# EAGLE design RFM95 LoRa Shield v0.2 (EAGLE 9.2.0)
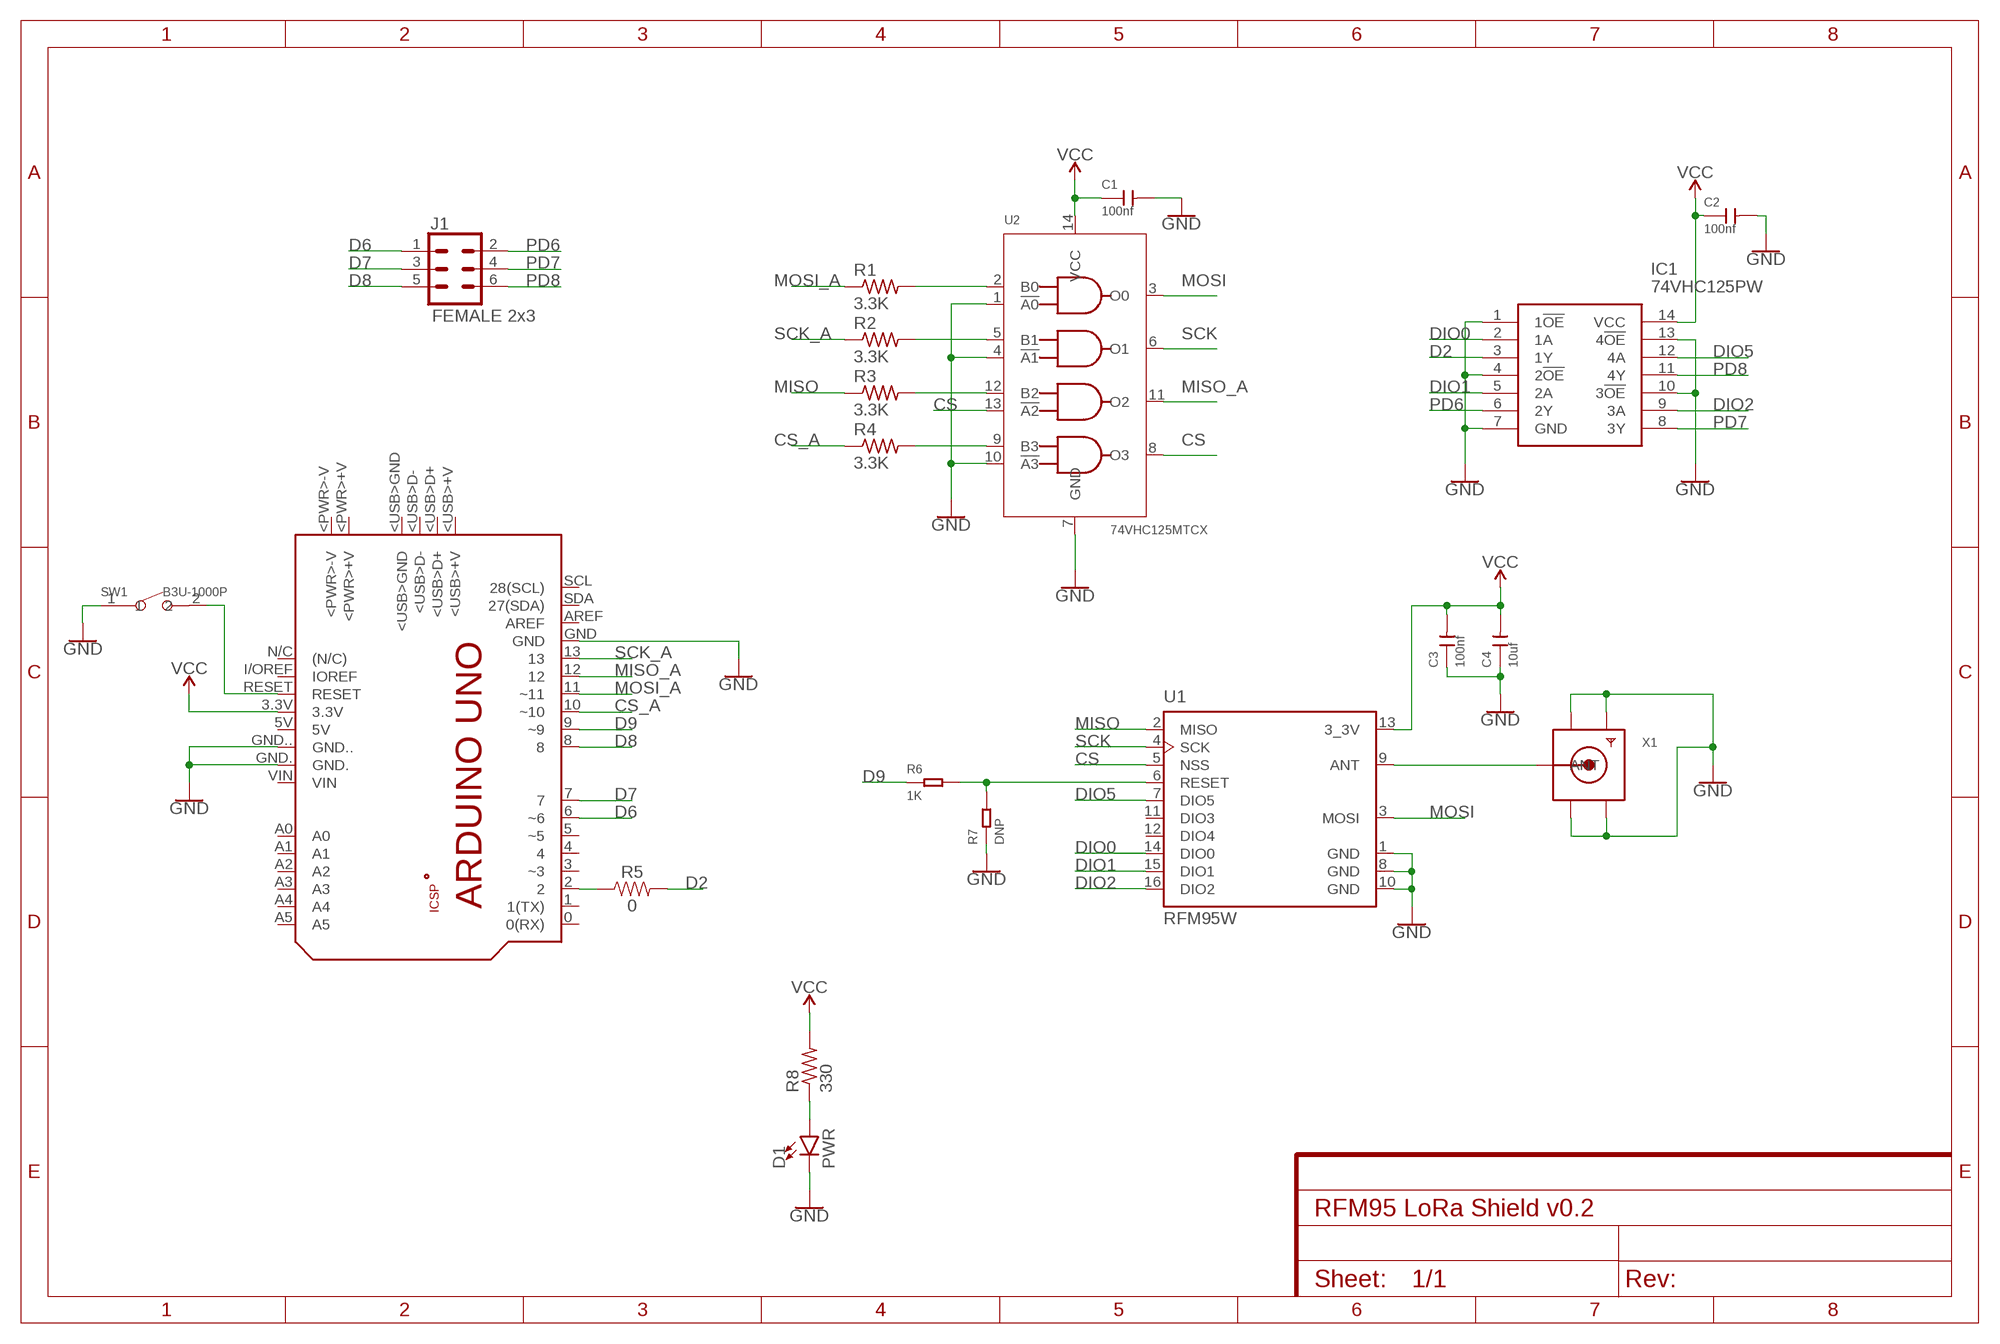
[diagram p0: schematic, sheet 1]

## Parts
C1  100nf  CERAMIC-100NF-50V-10%-X7R(0805)  [C0805]
C2  100nf  CERAMIC-100NF-50V-10%-X7R(0805)  [C0805]
C3  100nf  CERAMIC-100NF-50V-10%-X7R(0805)  [C0805]
C4  10uf  CERAMIC-10UF-25V-10%-X5R(0805)  [C0805]
D1  PWR  LED-GREEN1206  [LED-1206]
IC1  74VHC125PW  74VHC125PW,118  [SOP65P640X110-14N]
J1  FEMALE 2x3  CONN_03X2FEMALE  [2X3]
PCB1  Arduino Uno  ARDUINO_UNO  [ARDUINO_UNO]
R1  3.3K  R-US_M0805  [M0805]
R2  3.3K  R-US_M0805  [M0805]
R3  3.3K  R-US_M0805  [M0805]
R4  3.3K  R-US_M0805  [M0805]
R5  0  0OHM-0603-1/10W-5%  [0603]
R6  1K  SMD-RES-1K-5%-1/8W(0805)  [R0805]
R7  DNP  SMD-RES-1K-5%-1/8W(0805)  [R0805]
R8  330  R-US_M0805  [M0805]
SW1  B3U-1000P  SMD-BUTTON(2P-3.0X2.5X1.2+0.4MM)-B3U-1000P-2P-SMD  [SW2-2.6-3.0X2.5X1.2+0.4MM]
U1  RFM95W  RFM95W-868S2  [XCVR_RFM95W-868S2]
U2  74VHC125MTCX  LOGIC-74VHC125MTCX(TSSOP14)  [TSSOP14-0.65-5X4.4MM]
X1  SMACONNECTOR  [SMA90_DIP]

## Nets
CS: U1.5(NSS) U2.8(O3) U2.13(!A2)
CS_A: PCB1.10(~10) R4.1
D2: IC1.3(1Y) R5.2
D6: J1.1 PCB1.6(~6)
D7: J1.3 PCB1.7
D8: J1.5 PCB1.8
D9: PCB1.9(~9) R6.1
DIO0: IC1.2(1A) U1.14(DIO0)
DIO1: IC1.5(2A) U1.15(DIO1)
DIO2: IC1.9(3A) U1.16(DIO2)
DIO5: IC1.12(4A) U1.7(DIO5)
GND: C1.2 C2.2 C3.1 C4.1 D1.C IC1.1(1!OE) IC1.4(2!OE) IC1.7(GND) IC1.10(3!OE) IC1.13(4!OE) PCB1.GND PCB1.GND. PCB1.GND.. R7.1 SW1.1 U1.1(GND) U1.8(GND) U1.10(GND) U2.1(!A0) U2.4(!A1) U2.7(GND) U2.10(!A3) X1.GND1 X1.GND2 X1.GND3 X1.GND4
MISO: R3.1 U1.2(MISO)
MISO_A: PCB1.12 U2.11(O2)
MOSI: U1.3(MOSI) U2.3(O0)
MOSI_A: PCB1.11(~11) R1.1
N$1: R1.2 U2.2(B0)
N$2: R2.2 U2.5(B1)
N$3: R3.2 U2.12(B2)
N$4: R4.2 U2.9(B3)
N$5: PCB1.2 R5.1
N$6: R6.2 R7.2 U1.6(RESET)
N$7: U1.9(ANT) X1.ANTENNA(ANT)
N$8: PCB1.RESET SW1.2
N$9: D1.A R8.1
PD6: IC1.6(2Y) J1.2
PD7: IC1.8(3Y) J1.4
PD8: IC1.11(4Y) J1.6
SCK: U1.4(SCK) U2.6(O1)
SCK_A: PCB1.13 R2.1
VCC: C1.1 C2.1 C3.2 C4.2 IC1.14(VCC) PCB1.3.3V R8.2 U1.13(3_3V) U2.14(VCC)
Unconnected: PCB1.0(0(RX)) PCB1.1(1(TX)) PCB1.3(~3) PCB1.4 PCB1.5(~5) PCB1.5V PCB1.+5V PCB1.<PWR>+V PCB1.<PWR>-V PCB1.<USB>+V PCB1.<USB>D+ PCB1.<USB>D- PCB1.<USB>GND PCB1.A0 PCB1.A1 PCB1.A2 PCB1.A3 PCB1.A4 PCB1.A5 PCB1.AREF PCB1.GND_ PCB1.I/OREF(IOREF) PCB1.MISO PCB1.MOSI PCB1.N/C((N/C)) PCB1.RESET. PCB1.SCK PCB1.SCL(28(SCL)) PCB1.SDA(27(SDA)) PCB1.VIN U1.11(DIO3) U1.12(DIO4)

## Library data of the parts
C1-C3 = Seeed-Capacitor:CERAMIC-100NF-50V-10%-X7R(0805): 302010165; MPN: CC0805KRX7R9BB104
C4 = Seeed-Capacitor:CERAMIC-10UF-25V-10%-X5R(0805): 302010178; MPN: CC0805KKX5R8BB106
D1 = SparkFun-LED:LED-GREEN: Green SMD LED Used in manufacturing of various products at SparkFun Packages: 0603 - SMD 0603 package [Product Link] <http://www.futureelectronics.com/en/technologies/semiconductors/optoelectronics/leds/Pages/9894312-LTST-C190GKT.aspx?CrossPart=HSMG-C190&IM=0> LilyPad 1206 - SMD1206 LilyPad package [Product Link] <http://www.futureelectronics.com/en/Technologies/Product.aspx?ProductID=IN150NGHARVATEKCORPORATION2049943&IM=0> 1206 - SMD1206 package [Product Link] <http://www.futureelectronics.com/en/technologies/semiconductors/optoelectronics/leds/Pages/8315665-LTST-C150KGKT.aspx?IM=0> 1206 Bottom Mount -SMD 1206 Bottom Mount [Product Link] <http://www.digikey.com/product-detail/en/lite-on-inc/LTST-C230KGKT/160-1456-1-ND/386854> SparkFun Products: Pro Mini 328 -5V <https://www.sparkfun.com/products/821> RedBoard <https://www.sparkfun.com/products/12757> MP3 Trigger <https://www.sparkfun.com/products/13720> Makey Makey <https://www.sparkfun.com/products/11076>; PROD_ID: DIO-00862; VALUE: GREEN
IC1 = 74VHC125PW_118:74VHC125PW,118: Buffers & Line Drivers CMOS 4CH NON-INVERT Source: Datasheet <https://assets.nexperia.com/documents/data-sheet/74VHC_VHCT125.pdf>; DESCRIPTION: Buffers & Line Drivers CMOS 4CH NON-INVERT; HEIGHT: 1.1mm; MANUFACTURER_NAME: Nexperia; MANUFACTURER_PART_NUMBER: 74VHC125PW,118
J1 = SparkFun-Connectors:CONN_03X2: Multi connection point. Often used as Generic Header-pin footprint for 0.1 inch spaced/style header connections You can populate with any combo of single row headers, but if you'd like an exact match, check these: Header - 2x3 (Male, 0.1") <https://www.sparkfun.com/products/12807> (PRT-12807) Header - 2x3 (Female, 0.1") <https://www.sparkfun.com/products/13010> (PRT-13010) 2x3 Pin Shrouded Header <https://www.sparkfun.com/products/10877> (PRT-10877) On any of the 0.1 inch spaced packages, you can populate with these: Break Away Headers - Straight <https://www.sparkfun.com/products/116> (PRT-00116) Break Away Male Headers - Right Angle <https://www.sparkfun.com/products/553> (PRT-00553) Female Headers <https://www.sparkfun.com/products/115> (PRT-00115) Break Away Headers - Machine Pin <https://www.sparkfun.com/products/117> (PRT-00117) Break Away Female Headers - Swiss Machine Pin <https://www.sparkfun.com/products/743> (PRT-00743) Special note: the shrouded connector mates well with our 3x2 ribbon cables: Ribbon Crimp Connector - 6-pin (2x3, Female) <https://www.sparkfun.com/products/10651> (PRT-10651) Ribbon Cable - 6 wire (15ft) <https://www.sparkfun.com/products/10646> (PRT-10646); PROD_ID: CONN-11566
PCB1 = E14_Arduino_revC:ARDUINO_UNO: Device for representing an Arduino Uno board with a footprint in an EAGLE design. Created by Dave Young for Element14. More EAGLE documentation at: http://www.element14.com/community/community/knode/cadsoft_eagle
R1-R4 R8 = resistor:R-US_: RESISTOR, American symbol
R5 = SparkFun-Resistors:0OHM: 0Ω resistor A resistor is a passive two-terminal electrical component that implements electrical resistance as a circuit element. Resistors act to reduce current flow, and, at the same time, act to lower voltage levels within circuits. - Wikipedia; PROD_ID: RES-08609
R6 = Seeed-Resistor:SMD-RES-1K-5%-1/8W(0805): 301010311; MPN: RC0805JR-071KL
R7 = Seeed-Resistor:SMD-RES-1K-5%-1/8W(0805): 301010311; MPN: RC0805JR-071KL; VALUE: 1K
SW1 = Seeed-Switch:SMD-BUTTON(2P-3.0X2.5X1.2+0.4MM): 311020047; MPN: B3U-1000P-2P-SMD; VALUE: B3U-1000P-2P-SMD
U1 = RFM95W-868S2:RFM95W-868S2: Mod Txrx Lora +20dbm 868mhz Smd; MF: RF; MP: RFM95W-868S2; PACKAGE: SMD-16 Hope Microelectronics
U2 = Seeed-IC:LOGIC-74VHC125MTCX(TSSOP14): 310050042; MPN: 74VHC125MTCX; VALUE: 74VHC125MTCX-TSSOP14
X1 = adafruit:SMACONNECTOR: SMA Connector 90° DIP SMA Connector, 50 Ohm (4UConnector: 07259)

## Board
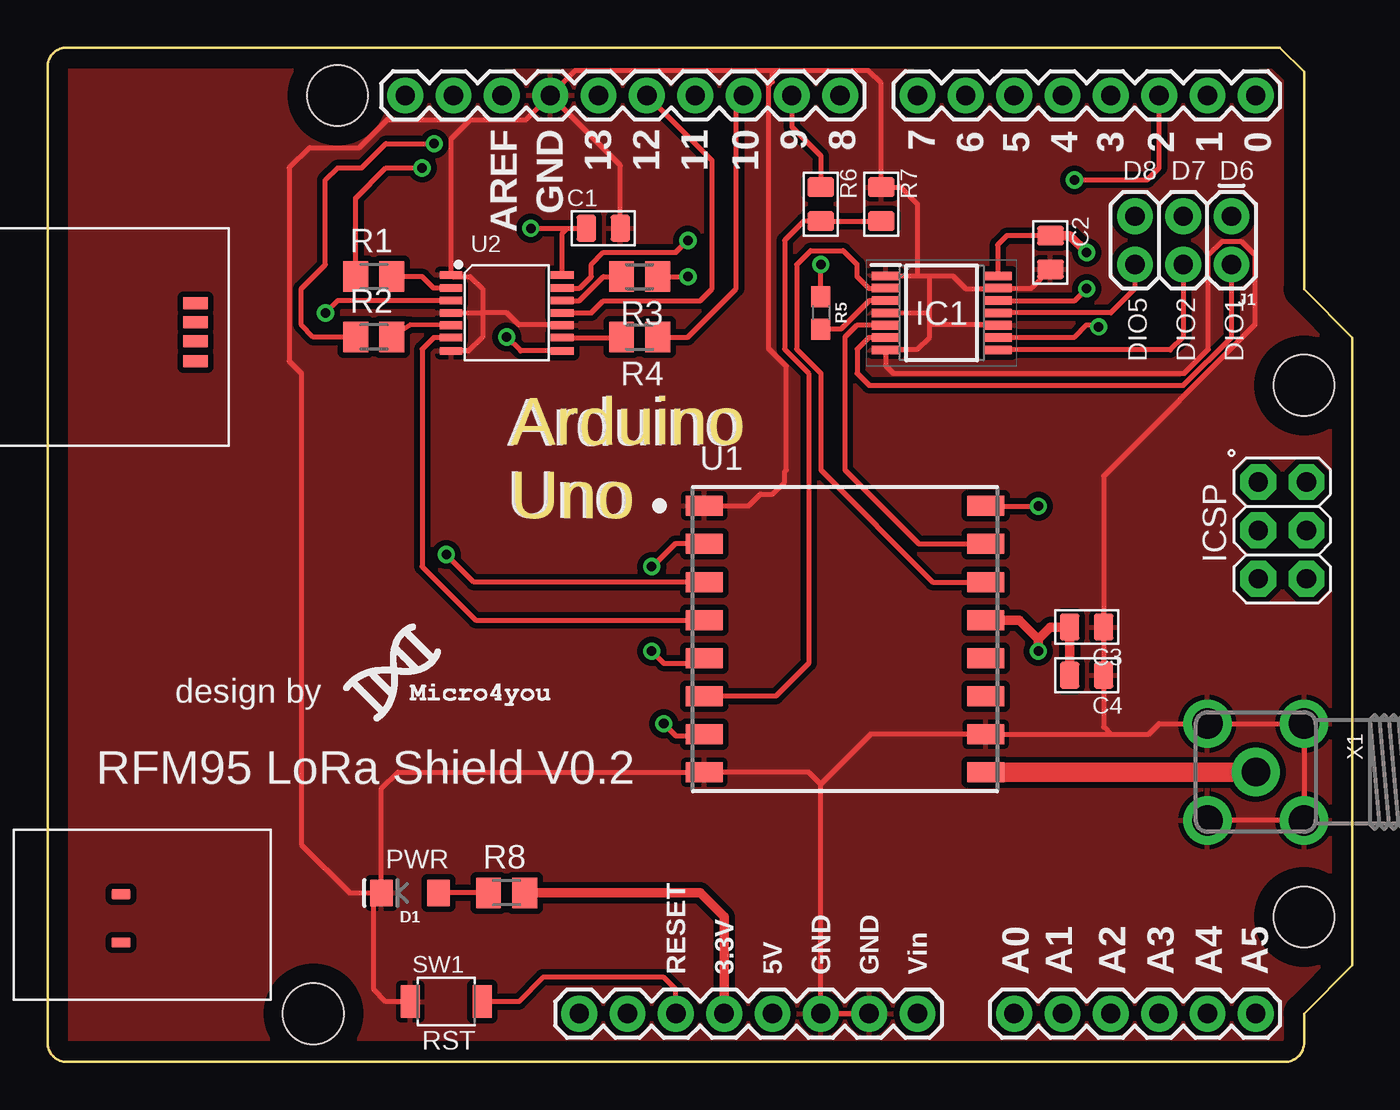
[diagram p1: board, top side]
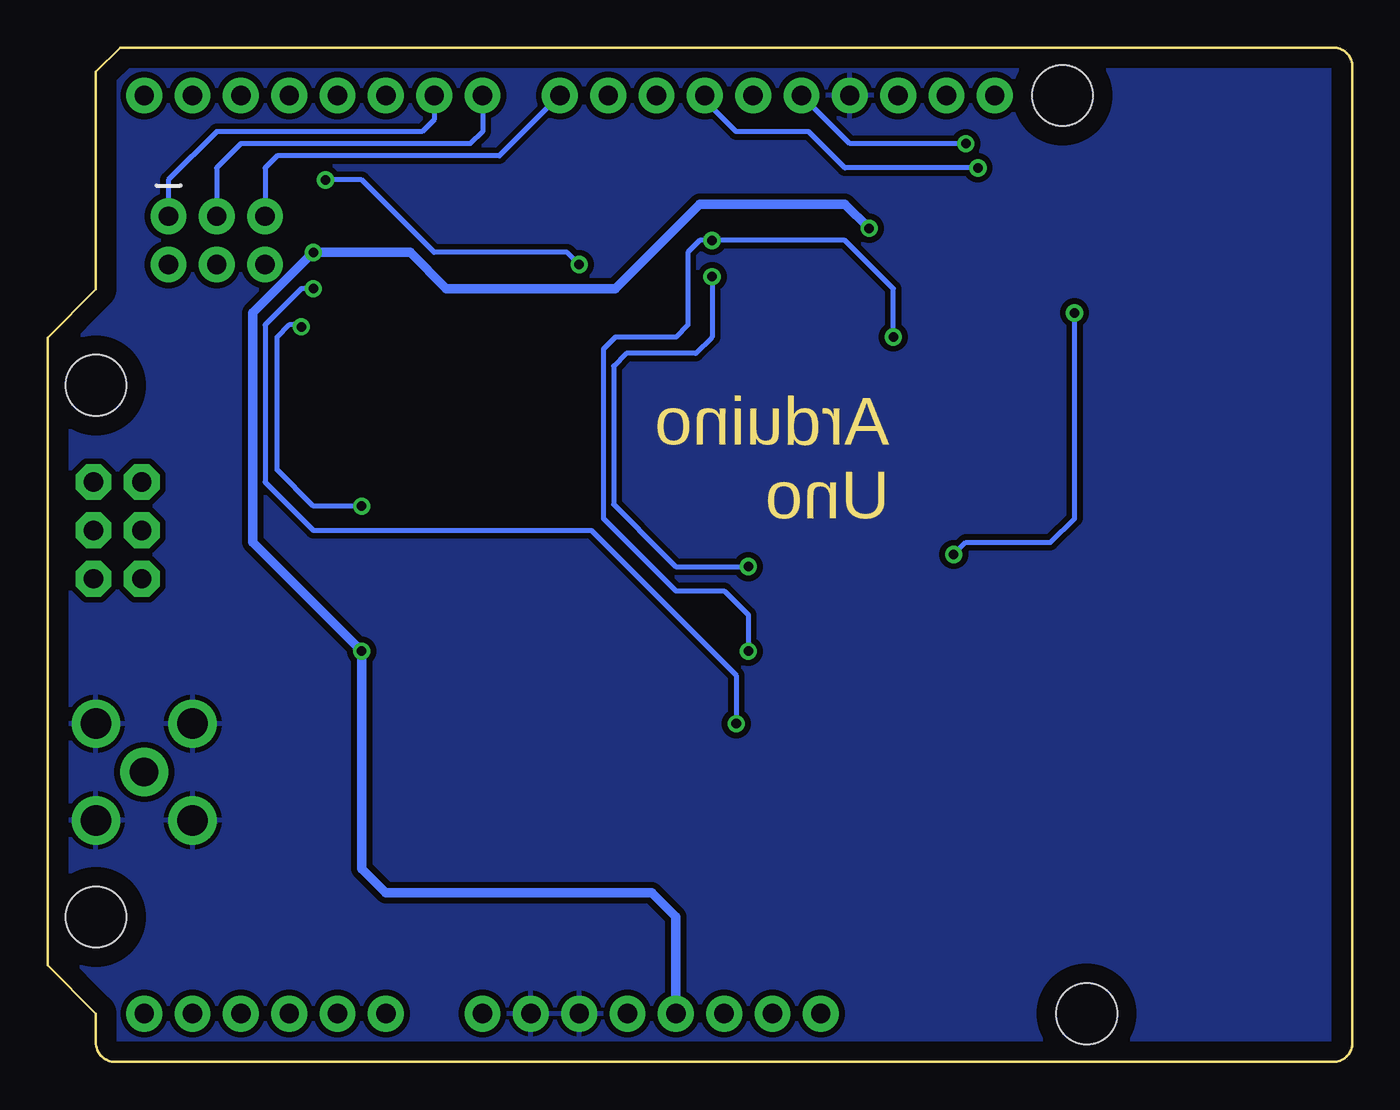
[diagram p2: board, bottom side, seen from below]

Size 68.58 x 53.31 mm. Coordinates in mm from the lower left corner, seen from the top.
Copper layers (1*16): Top 0.035mm / dielectric 1.5mm / Bottom 0.035mm
Design rules "default": minimum track width 6mil, minimum drill 0.35mm, track to track 6mil, track to pad 6mil, pad to pad 6mil, via to via 6mil, smd to smd 6mil, copper to edge 40mil, drill to drill 6mil, minimum pad ring 10mil, minimum via ring 8mil, stop-mask expansion 4mil, vias tented up to drill 0mil, thermal gap 10mil

### Footprints (pad centres in the part's own frame; a part is rotated, then mirrored left to right if it is on the bottom)
C0805 = smd 1.397 x 1.016: 1 0,0.889; 2 0,-0.889
LED-1206 = smd 1.2 x 1.4: A -1.5,0; C 1.5,0
SOP65P640X110-14N = smd 1.475 x 0.45: 1 -2.938,1.95; 2 -2.938,1.3; 3 -2.938,0.65; 4 -2.938,0; 5 -2.938,-0.65; 6 -2.938,-1.3; 7 -2.938,-1.95; 8 2.938,-1.95; 9 2.938,-1.3; 10 2.938,-0.65; 11 2.938,0; 12 2.938,0.65; 13 2.938,1.3; 14 2.938,1.95
2X3 = drill 1.016 pad 1.88: 1 0,0; 2 0,2.54; 3 2.54,0; 4 2.54,2.54; 5 5.08,0; 6 5.08,2.54
ARDUINO_UNO = drill 1.016 pad 1.88: 0 63.5,50.8; 1 60.96,50.8; 2 58.42,50.8; 3 55.88,50.8; 3.3V 35.56,2.54; 4 53.34,50.8; 5 50.8,50.8; 5V 38.1,2.54; 6 48.26,50.8; 7 45.72,50.8; 8 41.656,50.8; 9 39.116,50.8; 10 36.576,50.8; 11 34.036,50.8; 12 31.496,50.8; 13 28.956,50.8; A0 50.8,2.54; A1 53.34,2.54; A2 55.88,2.54; A3 58.42,2.54; A4 60.96,2.54; A5 63.5,2.54; AREF 23.876,50.8; GND 26.416,50.8; GND. 43.18,2.54; GND.. 40.64,2.54; I/OREF 30.48,2.54; N/C 27.94,2.54; RESET 33.02,2.54; SCL 18.796,50.8; SDA 21.336,50.8; VIN 45.72,2.54 | drill 1.016 pad 1.88 octagon: +5V 66.167,30.48; GND_ 66.167,25.4; MISO 63.627,30.48; MOSI 66.167,27.94; RESET. 63.627,25.4; SCK 63.627,27.94 | smd 1.016 x 0.508: <PWR>+V 3.861,8.814; <PWR>-V 3.861,6.274 | smd 1.27 x 0.635: <USB>+V 7.772,39.878; <USB>D+ 7.772,38.887; <USB>D- 7.772,37.871; <USB>GND 7.772,36.83 | hole 3.2: 66.04,7.62; 66.04,35.56; 15.24,50.8; 13.97,2.54
M0805 = smd 1.3 x 1.6: 1 -0.95,0; 2 0.95,0
0603 = smd 1.1 x 1: 1 -0.85,0; 2 0.85,0
R0805 = smd 1.397 x 1.016: 1 0,0.889; 2 0,-0.889
SW2-2.6-3.0X2.5X1.2+0.4MM = smd 1 x 1.7: 1 -1.9,0; 2 1.9,0
XCVR_RFM95W-868S2 = smd 1.95 x 1.05: 1 -7.4,7; 2 -7.4,5; 3 -7.4,3; 4 -7.4,1; 5 -7.4,-1; 6 -7.4,-3; 7 -7.4,-5; 8 -7.4,-7; 9 7.4,-7; 10 7.4,-5; 11 7.4,-3; 12 7.4,-1; 13 7.4,1; 14 7.4,3; 15 7.4,5; 16 7.4,7
TSSOP14-0.65-5X4.4MM = smd 0.4 x 1.2: 1 -2,-2.925; 2 -1.3,-2.925; 3 -0.65,-2.925; 4 0,-2.925; 5 0.65,-2.925; 6 1.3,-2.925; 7 2,-2.925; 8 2,2.925; 9 1.3,2.925; 10 0.65,2.925; 11 0,2.925; 12 -0.65,2.925; 13 -1.3,2.925; 14 -2,2.925
SMA90_DIP = drill 1.5 pad 2.54: ANTENNA 0,0 | drill 1.6 pad 2.54: GND1 -2.54,2.54; GND2 2.54,2.54; GND3 -2.54,-2.54; GND4 2.54,-2.54

### Placement (x,y rotation side)
C1  29.21,43.81 90 top
C2  52.71,42.55 0 top
C3  54.61,22.86 270 top
C4  54.61,20.32 270 top
D1  19.05,8.89 180 top
IC1  46.99,39.37 0 top
J1  62.23,44.45 180 top
PCB1  0,0 0 top
R1  17.14,41.27 0 top
R2  17.14,38.1 0 top
R3  31.12,41.27 180 top
R4  31.12,38.1 180 top
R5  40.64,39.37 270 top
R6  40.64,45.08 0 top
R7  43.82,45.08 0 top
R8  24.13,8.89 0 top
SW1  20.95,3.17 0 top
U1  41.91,22.22 0 top
U2  24.13,39.37 270 top
X1  63.5,15.24 270 top

### Tracks (layer width: path | path; a pad name or v marks a point on that pad's centre or on a via)
CS  (via drill 0.5)
  Top 0.254: U2.13 27.97,40.67 28.57,41.27 28.57,41.91 29.21,42.55 33.02,42.55 v33.66,43.18 | v31.75,21.59 32.38,20.96 34.24,20.96 U1.5 | U2.8 24.86,37.37 v24.13,38.1
  Bottom 0.254: v31.75,21.59 31.75,23.5 33.02,24.76 35.56,24.76 39.37,28.57 39.37,37.47 38.73,38.1 35.56,38.1 34.93,38.73 34.93,42.55 34.29,43.18 v33.66,43.18 26.67,43.18 24.13,40.64 v24.13,38.1
CS_A
  Top 0.254: R4.1 33.66,38.1 36.2,40.64 36.2,50.42 PCB1.10
D2
  Top 0.254: IC1.3 43.2,40.02 41.7,38.52 R5.2
D6
  Bottom 0.254: PCB1.6 48.26,49.53 48.9,48.89 59.69,48.89 62.23,46.36 J1.1
D7
  Bottom 0.254: PCB1.7 45.72,48.89 46.35,48.26 58.42,48.26 59.69,46.99 J1.3
D8
  Bottom 0.254: PCB1.8 44.83,47.62 56.51,47.62 57.15,46.99 J1.5
D9
  Top 0.254: PCB1.9 39.12,49.15 40.64,47.62 R6.1
DIO0
  Top 0.254: IC1.2 44.02,40.64 43.18,40.64 42.54,41.27 42.54,41.91 41.81,42.64 40.1,42.64 39.37,41.91 39.37,37.47 40.64,36.19 40.64,31.11 46.53,25.22 U1.14
DIO1
  Top 0.254: IC1.5 42.53,38.72 41.91,38.1 41.91,31.11 45.8,27.22 U1.15
DIO2  (via drill 0.5)
  Top 0.254: IC1.9 49.96,38.1 53.98,38.1 54.61,38.73 55.15,38.73 v55.24,38.64 | U1.16 49.32,29.21 v52.07,29.21
  Bottom 0.254: v55.24,38.64 55.34,38.73 55.88,38.73 56.51,38.1 56.51,31.11 54.61,29.21 v52.07,29.21
DIO5  (via drill 0.5)
  Top 0.254: IC1.12 53.99,40.02 v54.61,40.64 | v32.38,17.78 33.02,17.14 34.43,17.14 U1.7
  Bottom 0.254: v54.61,40.64 55.24,40.64 57.15,38.73 57.15,30.48 54.61,27.94 40.01,27.94 32.38,20.32 v32.38,17.78
GND
  Top 0.254: SW1.1 17.78,3.17 17.14,3.81 17.14,8.48 D1.C | PCB1.GND. PCB1.GND.. 40.64,14.6 | 40.64,14.6 40.01,15.24 39.99,15.22 34.93,15.22 U1.8 18.43,15.22 18.41,15.24 17.55,14.38 D1.C | 40.64,14.6 43.26,17.22 U1.10 55.88,17.22 | 55.88,17.22 57.87,17.22 58.42,17.78 X1.GND3 X1.GND1 X1.GND2 X1.GND4 | 55.88,17.22 55.5,17.61 C4.1 C3.1 55.5,30.79 63.45,38.74 63.45,42.41 62.73,43.13 61.73,43.13 61.01,42.41 61.01,37.46 59.75,36.19 44.45,36.19 44.05,36.59 IC1.7 44.1,37.47 45.72,37.47 46.35,38.1 46.35,38.73 | 22.86,39.37 22.86,40.64 22.23,41.27 21.3,41.27 U2.1 21.2,48.51 22.23,49.53 | 22.86,39.37 22.86,38.1 22.13,37.37 U2.7 | U2.4 22.86,39.37 | U2.10 27.04,38.73 24.77,38.73 24.13,39.37 22.86,39.37 | D1.C 15.88,8.89 13.34,11.43 13.34,36.19 12.7,36.83 12.7,46.99 13.77,48.06 16.38,48.06 17.85,49.53 22.23,49.53 | PCB1.GND 25.15,49.53 22.23,49.53 | C1.2 30.1,47.12 PCB1.GND | U1.1 36.85,29.22 37.46,29.84 38.1,29.84 38.73,30.48 38.73,31.02 38.83,31.12 38.83,36.57 37.9,37.5 37.9,51.3 38.1,51.51 38.1,52.11 | C2.2 51.72,40.67 IC1.13 49.9,40.64 48.26,40.64 47.58,41.32 46.35,41.32 | IC1.1 45.72,41.32 | 45.72,41.32 46.35,41.32 | 45.72,41.32 45.72,45.08 44.83,45.97 R7.1 43.82,51.43 43.14,52.11 38.1,52.11 | PCB1.GND 27.72,52.11 38.1,52.11 | 46.35,38.73 46.35,39.37 | 46.35,39.37 46.35,41.32 | IC1.4 46.35,39.37 | IC1.10 49.91,38.73 46.35,38.73
  pour Top (isolate 0.305): 0,53.34 69.22,53.34 69.22,1.27 67.94,0 0,0
  pour Bottom (isolate 0.305): 0,53.34 69.85,53.34 69.85,0.63 69.22,0 0,0
MISO  (via drill 0.5)
  Top 0.254: R3.1 v33.66,41.27 | U1.2 32.98,27.22 31.79,26.04 v31.75,26.04
  Bottom 0.254: v33.66,41.27 33.66,38.1 34.52,37.24 38.16,37.24 38.83,36.57 38.83,29.3 36.2,26.67 36.09,26.56 35.56,26.04 v31.75,26.04
MISO_A
  Top 0.254: U2.11 28.57,39.37 29.21,40 34.29,40 34.93,40.64 34.93,47.37 PCB1.12
MOSI  (via drill 0.5)
  Top 0.254: 21.19,40 U2.3 15.26,40.02 v14.6,39.37 | U1.3 22.4,25.22 v20.95,26.67
  Bottom 0.254: v20.95,26.67 20.32,27.3 15.88,27.3 14.6,28.57 v14.6,39.37
MOSI_A  (via drill 0.5)
  Top 0.254: R1.1 16.2,45.41 17.78,46.99 v19.69,46.99
  Bottom 0.254: v19.69,46.99 26.67,46.99 28.57,48.89 32.38,48.89 34.04,50.55 PCB1.11
N$1
  Top 0.254: 21.17,40.64 arc90 U2.2 20.29,40.67 19.69,41.27 R1.2
N$2
  Top 0.254: U2.5 19.05,38.73 R2.2
N$3
  Top 0.254: U2.12 27.95,40.02 29.21,41.27 R3.2
N$4
  Top 0.254: 27.09,38.1 U2.9 30.13,38.07 R4.2
N$5  (via drill 0.5)
  Top 0.254: R5.1 v40.64,41.91 | v53.98,46.36 57.79,46.36 58.42,46.99 PCB1.2
  Bottom 0.254: v40.64,41.91 41.27,42.55 48.26,42.55 52.07,46.36 v53.98,46.36
N$6
  Top 0.254: R7.2 R6.2 39.75,44.2 38.73,43.18 38.73,37.47 40.01,36.19 40.01,20.96 38.27,19.22 U1.6
N$7
  Top 0.254: 63.48,15.22 X1.ANTENNA
  Top 1.016: U1.9 63.48,15.22
N$8
  Top 0.254: PCB1.RESET 33.02,3.81 32.38,4.44 26.03,4.44 24.77,3.17 SW1.2
N$9
  Top 0.254: R8.1 D1.A
PD6
  Top 0.254: IC1.6 43.15,38.07 42.54,37.47 42.54,36.19 43.18,35.56 59.69,35.56 62.23,38.1 J1.2
PD7
  Top 0.254: J1.4 59.69,38.1 59.01,37.42 IC1.8
PD8
  Top 0.254: J1.6 57.15,40.64 55.88,39.37 IC1.11
SCK
  Top 0.254: U2.6 20.29,38.07 19.69,37.47 19.69,26.04 22.49,23.22 U1.4
SCK_A  (via drill 0.5)
  Top 0.254: R2.1 13.97,38.1 13.34,38.73 13.34,40.64 14.6,41.91 14.6,46.36 15.24,46.99 16.51,46.99 17.78,48.26 v20.32,48.26
  Bottom 0.254: v20.32,48.26 26.42,48.26 PCB1.13
VCC  (via drill 0.5)
  Top 0.254: U2.14 27.05,43.56 27.3,43.81 | 27.3,43.81 C1.1 | C2.1 50.42,43.43 49.93,42.94 IC1.14 | v25.4,43.81 27.3,43.81
  Top 0.508: PCB1.3.3V 35.56,7.62 34.29,8.89 R8.2 | v52.07,21.59 52.07,22.22 | 52.07,22.22 52.71,22.86 C3.2 C4.2 | 52.07,22.22 51.07,23.22 U1.13 | C2.1 53.72,43.43 v54.61,42.55
  Bottom 0.508: PCB1.3.3V 35.56,7.62 36.83,8.89 50.8,8.89 52.07,10.16 v52.07,21.59 57.79,27.3 57.79,39.37 v54.61,42.55 49.53,42.55 47.62,40.64 38.73,40.64 34.29,45.08 26.67,45.08 v25.4,43.81

### Text on the board
tPlace: D8 | D7 | D6 | DIO5 | DIO2 | DIO1 | Arduino | Uno | design by | RFM95 LoRa Shield V0.2 | PWR | RST